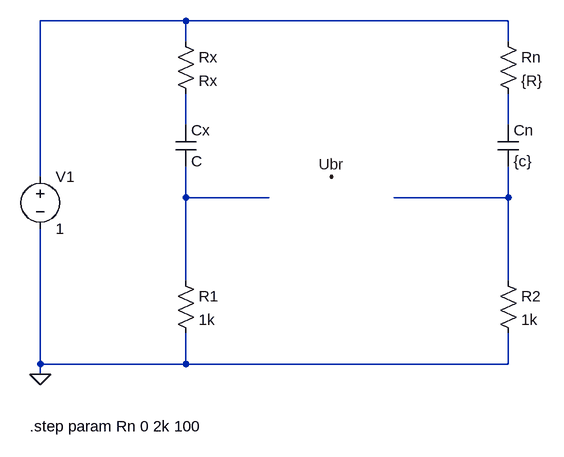
[diagram p0: schematic ACBridgeCircuit.asc]
ACBridgeCircuit.asc, the LTspice schematic file:
Version 4
SHEET 1 1008 680
WIRE 112 32 -112 32
WIRE 608 32 112 32
WIRE 112 64 112 32
WIRE 608 64 608 32
WIRE 112 192 112 144
WIRE 608 192 608 144
WIRE -112 272 -112 32
WIRE 112 304 112 256
WIRE 240 304 112 304
WIRE 608 304 608 256
WIRE 608 304 432 304
WIRE 112 432 112 304
WIRE 608 432 608 304
WIRE -112 560 -112 352
WIRE 112 560 112 512
WIRE 112 560 -112 560
WIRE 608 560 608 512
WIRE 608 560 112 560
WIRE -112 576 -112 560
FLAG -112 576 0
FLAG 336 272 Ubr
SYMBOL res 96 48 R0
SYMATTR InstName Rx
SYMATTR Value Rx
SYMBOL res 96 416 R0
SYMATTR InstName R1
SYMATTR Value 1k
SYMBOL res 592 416 R0
SYMATTR InstName R2
SYMATTR Value 1k
SYMBOL res 592 48 R0
SYMATTR InstName Rn
SYMATTR Value {R}
SYMBOL cap 96 192 R0
SYMATTR InstName Cx
SYMBOL cap 592 192 R0
SYMATTR InstName Cn
SYMATTR Value {c}
SYMBOL LTspice_EuroComponents\\voltage -112 256 R0
SYMATTR InstName V1
SYMATTR Value 1
TEXT -128 656 Left 2 !.step param Rn 0 2k 100

The netlist it stands for:
* ACBridgeCircuit.asc
Rx N001 N002 Rx
R1 N004 0 1k
R2 N005 0 1k
Rn N001 N003 {R}
Cx N002 N004 C
Cn N003 N005 {c}
V1 N001 0 1
.step param Rn 0 2k 100
.backanno
.end